# Altium schematic sheet poker_shematics_2.SchDoc
size A4
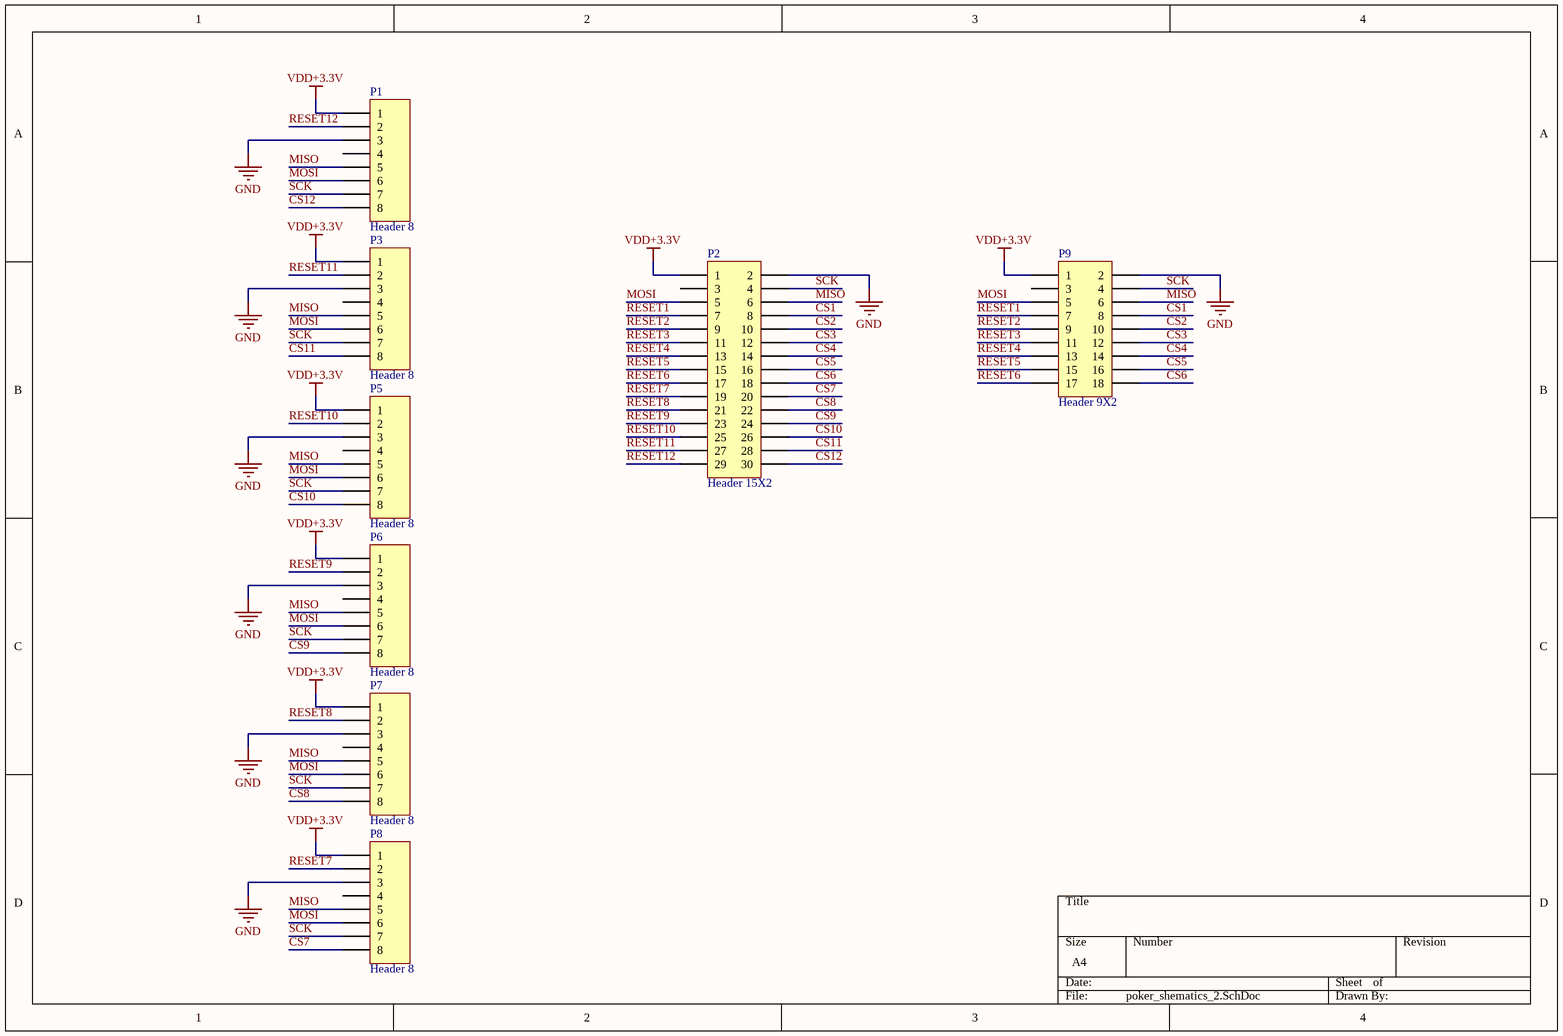
[diagram p0: poker_shematics_2.SchDoc]

## Parts
P1  Header 8  [HDR1X8]
P2  Header 15X2  [HDR2X15]
P3  Header 8  [HDR1X8]
P5  Header 8  [HDR1X8]
P6  Header 8  [HDR1X8]
P7  Header 8  [HDR1X8]
P8  Header 8  [HDR1X8]
P9  Header 9X2  [HDR2X9]

## Nets
GND: P1.3 P2.2 P3.3 P5.3 P6.3 P7.3 P8.3 P9.2
VDD+3.3V: P1.1 P2.1 P3.1 P5.1 P6.1 P7.1 P8.1 P9.1
CS1: P2.8 P9.8
CS2: P2.10 P9.10
CS3: P2.12 P9.12
CS4: P2.14 P9.14
CS5: P2.16 P9.16
CS6: P2.18 P9.18
CS7: P2.20 P8.8
CS8: P2.22 P7.8
CS9: P2.24 P6.8
CS10: P2.26 P5.8
CS11: P2.28 P3.8
CS12: P1.8 P2.30
MISO: P1.5 P2.6 P3.5 P5.5 P6.5 P7.5 P8.5 P9.6
MOSI: P1.6 P2.5 P3.6 P5.6 P6.6 P7.6 P8.6 P9.5
RESET1: P2.7 P9.7
RESET2: P2.9 P9.9
RESET3: P2.11 P9.11
RESET4: P2.13 P9.13
RESET5: P2.15 P9.15
RESET6: P2.17 P9.17
RESET7: P2.19 P8.2
RESET8: P2.21 P7.2
RESET9: P2.23 P6.2
RESET10: P2.25 P5.2
RESET11: P2.27 P3.2
RESET12: P1.2 P2.29
SCK: P1.7 P2.4 P3.7 P5.7 P6.7 P7.7 P8.7 P9.4

Not connected (* = marked no-connect by the designer): P1 4; P2 3; P3 4; P5 4; P6 4; P7 4; P8 4; P9 3

## Library data of the parts
P1 P3 P5-P8 = Header 8: Header, 8-Pin; LatestRevisionDate: 17-Jul-2002; LatestRevisionNote: Re-released for DXP Platform.; Publisher: Altium Limited
P2 = Header 15X2: Header, 15-Pin, Dual row; LatestRevisionDate: 17-Jul-2002; LatestRevisionNote: Re-released for DXP Platform.; Publisher: Altium Limited
P9 = Header 9X2: Header, 9-Pin, Dual row; LatestRevisionDate: 17-Jul-2002; LatestRevisionNote: Re-released for DXP Platform.; Publisher: Altium Limited